# Altium schematic sheet MCU.SchDoc
size A4; PageSetup: Record=PageOptions|CenterHorizontal=True|CenterVertical=True|PrintScale=0.98|XCorrection=1.00|YCorrection=1.00|PrintKind=1|BorderSize=5000000|LeftOffset=0|BottomOffset=0|Orientation=2|PaperLength=1000|PaperWidth=1000|Scale=100|PaperSource=7|PrintQuality=-3|MediaType=1|DitherType=10|PrintScaleMode=1|PaperKind=Carta|PaperIndex=1
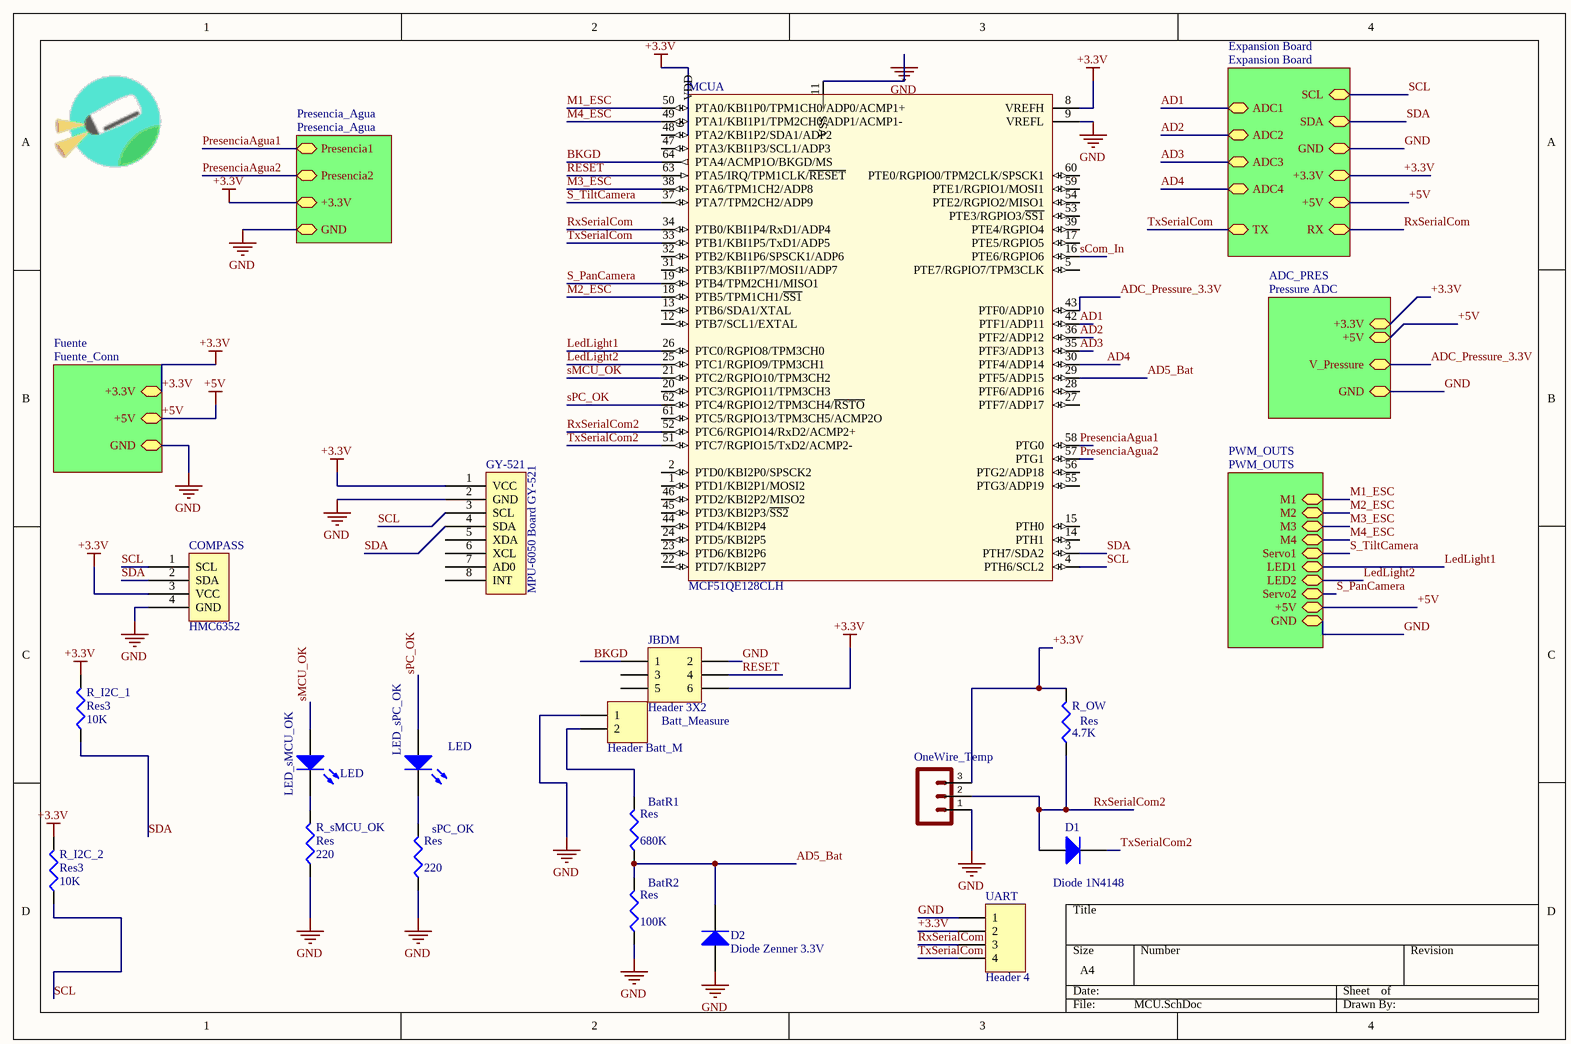
[diagram p0: MCU.SchDoc]

## Parts
BatR1  Res  value 680K  [6-0805_L]
BatR2  Res  value 100K  [6-0805_L]
Batt_Measure  Header Batt_M  [5.08mm 200 mil Screw Terminal SF]
COMPASS  HMC6352  [HMC6352_SF]
D1  Diode 1N4148  [miniMELF]
D2  Diode Zenner 3.3V  [miniMELF]
GY-521  MPU-6050 Board GY-521  [GY-521]
JBDM  Header 3X2  [HDR2X3]
LED_sMCU_OK  LED  [6-0805_L]
LED_sPC_OK  LED  [6-0805_L]
MCU  MCF51QE128CLH  [840F-02_N]  (part A of 2)
OneWire_Temp  (no value)  [HDR1X3]
R_I2C_1  Res3  value 10K  [6-0805_L]
R_I2C_2  Res3  value 10K  [6-0805_L]
R_OW  Res  value 4.7K  [6-0805_L]
R_sMCU_OK  Res  value 220  [6-0805_L]
sPC_OK  Res  value 220  [6-0805_L]
UART  Header 4  [HDR1X4]

## Sub-sheets
ADC_PRES = Pressure ADC: +3.3V, GND, V_Pressure (bidir), +5V
Expansion Board = Expansion Board: SCL, SDA, GND, +3.3V, +5V, ADC4 (bidir), ADC1 (bidir), ADC2 (bidir), ADC3 (bidir), RX, TX
Fuente = Fuente_Conn: +3.3V, +5V, GND
Presencia_Agua = Presencia_Agua: GND, +3.3V, Presencia2, Presencia1
PWM_OUTS = PWM_OUTS: M1, M2, M3, M4, LED1, LED2, +5V, GND, Servo1, Servo2

## Nets
+3.3V: COMPASS.3(VCC) GY-521.1(VCC) JBDM.6 MCU.6(VDD) MCU.8(VREFH) OneWire_Temp.3 R_I2C_1.2 R_I2C_2.2 R_OW.2 UART.2 ; sheet Fuente/+3.3V, sheet Expansion Board/+3.3V, sheet ADC_PRES/+3.3V, sheet Presencia_Agua/+3.3V
+5V: sheet Fuente/+5V, sheet Expansion Board/+5V, sheet ADC_PRES/+5V, sheet PWM_OUTS/+5V
GND: BatR2.1 Batt_Measure.1 COMPASS.4(GND) D2.1(A) GY-521.2(GND) JBDM.2 MCU.9(VREFL) MCU.11(VSS) OneWire_Temp.1 R_sMCU_OK.1 sPC_OK.1 UART.1 ; sheet Fuente/GND, sheet Expansion Board/GND, sheet ADC_PRES/GND, sheet PWM_OUTS/GND, sheet Presencia_Agua/GND
AD1: MCU.42(PTF1/ADP11) ; sheet Expansion Board/ADC1
AD2: MCU.36(PTF2/ADP12) ; sheet Expansion Board/ADC2
AD3: MCU.35(PTF3/ADP13) ; sheet Expansion Board/ADC3
AD4: MCU.30(PTF4/ADP14) ; sheet Expansion Board/ADC4
AD5_Bat: BatR1.1 BatR2.2 D2.2(K) MCU.29(PTF5/ADP15)
ADC_Pressure_3.3V: MCU.43(PTF0/ADP10) ; sheet ADC_PRES/V_Pressure
BKGD: JBDM.1 MCU.64(PTA4/ACMP1O/BKGD/MS)
LedLight1: MCU.26(PTC0/RGPIO8/TPM3CH0) ; sheet PWM_OUTS/LED1
LedLight2: MCU.25(PTC1/RGPIO9/TPM3CH1) ; sheet PWM_OUTS/LED2
M1_ESC: MCU.50(PTA0/KBI1P0/TPM1CH0/ADP0/ACMP1+) ; sheet PWM_OUTS/M1
M2_ESC: MCU.18(PTB5/TPM1CH1/~{SS1}) ; sheet PWM_OUTS/M2
M3_ESC: MCU.38(PTA6/TPM1CH2/ADP8) ; sheet PWM_OUTS/M3
M4_ESC: MCU.49(PTA1/KBI1P1/TPM2CH0/ADP1/ACMP1-) ; sheet PWM_OUTS/M4
PresenciaAgua1: MCU.58(PTG0) ; sheet Presencia_Agua/Presencia1
PresenciaAgua2: MCU.57(PTG1) ; sheet Presencia_Agua/Presencia2
RESET: JBDM.4 MCU.63(PTA5/IRQ/TPM1CLK/~{RESET})
RxSerialCom: MCU.34(PTB0/KBI1P4/RxD1/ADP4) UART.3 ; sheet Expansion Board/RX
RxSerialCom2: D1.1(A) MCU.52(PTC6/RGPIO14/RxD2/ACMP2+) OneWire_Temp.2 R_OW.1
S_PanCamera: MCU.19(PTB4/TPM2CH1/MISO1) ; sheet PWM_OUTS/Servo2
S_TiltCamera: MCU.37(PTA7/TPM2CH2/ADP9) ; sheet PWM_OUTS/Servo1
SCL: COMPASS.1(SCL) GY-521.3(SCL) MCU.4(PTH6/SCL2) R_I2C_2.1 ; sheet Expansion Board/SCL
sCom_In: MCU.16(PTE6/RGPIO6)
SDA: COMPASS.2(SDA) GY-521.4(SDA) MCU.3(PTH7/SDA2) R_I2C_1.1 ; sheet Expansion Board/SDA
sMCU_OK: LED_sMCU_OK.1(A) MCU.21(PTC2/RGPIO10/TPM3CH2)
sPC_OK: LED_sPC_OK.1(A) MCU.62(PTC4/RGPIO12/TPM3CH4/~{RSTO})
TxSerialCom: MCU.33(PTB1/KBI1P5/TxD1/ADP5) UART.4 ; sheet Expansion Board/TX
TxSerialCom2: D1.2(K) MCU.51(PTC7/RGPIO15/TxD2/ACMP2-)
NetBatR1_2: BatR1.2 Batt_Measure.2
NetLED_sMCU_OK_2: LED_sMCU_OK.2(K) R_sMCU_OK.2
NetLED_sPC_OK_2: LED_sPC_OK.2(K) sPC_OK.2

Not connected (* = marked no-connect by the designer): GY-521 5(XDA) 6(XCL) 7(AD0) 8(INT); JBDM 3 5; MCU 1(PTD1/KBI2P1/MOSI2) 2(PTD0/KBI2P0/SPSCK2) 5(PTE7/RGPIO7/TPM3CLK) 12(PTB7/SCL1/EXTAL) 13(PTB6/SDA1/XTAL) 14(PTH1) 15(PTH0) 17(PTE5/RGPIO5) 20(PTC3/RGPIO11/TPM3CH3) 22(PTD7/KBI2P7) 23(PTD6/KBI2P6) 24(PTD5/KBI2P5) 27(PTF7/ADP17) 28(PTF6/ADP16) 31(PTB3/KBI1P7/MOSI1/ADP7) 32(PTB2/KBI1P6/SPSCK1/ADP6) 39(PTE4/RGPIO4) 44(PTD4/KBI2P4) 45(PTD3/KBI2P3/~{SS2}) 46(PTD2/KBI2P2/MISO2) 47(PTA3/KBI1P3/SCL1/ADP3) 48(PTA2/KBI1P2/SDA1/ADP2) 53(PTE3/RGPIO3/~{SS1}) 54(PTE2/RGPIO2/MISO1) 55(PTG3/ADP19) 56(PTG2/ADP18) 59(PTE1/RGPIO1/MOSI1) 60(PTE0/RGPIO0/TPM2CLK/SPSCK1) 61(PTC5/RGPIO13/TPM3CH5/ACMP2O)

## Library data of the parts
BatR1 BatR2 R_I2C_1 R_I2C_2 R_OW R_sMCU_OK sPC_OK = Res3: Resistor; Published: 8-Jun-2000; LatestRevisionDate: 29-May-2009; LatestRevisionNote: IPC-7351 Footprint Added.; PackageReference: J1-0603; Publisher: Altium Limited; PackageDescription: Chip Resistor
Batt_Measure = Header 2: Header, 2-Pin; LatestRevisionDate: 17-Jul-2002; LatestRevisionNote: Re-released for DXP Platform.; Publisher: Altium Limited
D1 D2 = Diode 1N4148: High Conductance Fast Diode; Published: 8-Jun-2000; LatestRevisionDate: 17-Jul-2002; LatestRevisionNote: Re-released for DXP Platform.; DatasheetVersion: 1997; PackageReference: DO-35; Publisher: Altium Limited; PackageDescription: Diode, Axial; Body 3.8 x 1.9 mm (LxDia. max), Lead Dia. 0.53 mm (max); Code_JEDEC: DO-204-AH; ComponentLink1Description: Manufacturer Link; ComponentLink1URL: http://www.fairchildsemi.com/; ComponentLink2Description: Datasheet; ComponentLink2URL: http://www.fairchildsemi.com/ds/1N%2F1N4148.pdf
GY-521 = GY-521
JBDM = Header 3X2: Header, 3-Pin, Dual row; LatestRevisionDate: 17-Jul-2002; LatestRevisionNote: Re-released for DXP Platform.; Publisher: Altium Limited
LED_sMCU_OK LED_sPC_OK = LED2: Typical RED, GREEN, YELLOW, AMBER GaAs LED; Published: 8-Jun-2000; LatestRevisionDate: 17-Jul-2002; LatestRevisionNote: Re-released for DXP Platform.; PackageVersion: Feb-2002; PackageReference: 3.2X1.6X1.1; Publisher: Altium Limited; PackageDescription: SM LED; 2 Flat Leads
MCU = MCF51QE128CLH: MCF51QE128 ColdFire V1 Microcontroller, 32-Bit, 128KB Flash, 8KB RAM, -40°C to 85°C, 64-Pin LQFP; DatasheetVersion: rev7, Oct-2008; PackageVersion: rev6, Mar-2011; PackageReference: 840F-02; PackageDescription: 64-Pin Thin Quad Flat Pack, 10 x 10 mm Body, 0.5 mm Pitch; ComponentLink1Description: Manufacturer URL; ComponentLink1URL: http://www.freescale.com/; ComponentLink2Description: Datasheet; ComponentLink2URL: http://cache.freescale.com/files/32bit/doc/data_sheet/MCF51QE128.pdf?fpsp=1&WT_TYPE=Data%20Sheets&WT_VENDOR=FREESCALE&WT_FILE_FORMAT=pdf&WT_ASSET=Documentation
OneWire_Temp = M03-SCREW-5MM: STOREFRONT_ID: PRT-08433
UART = Header 4: Header, 4-Pin; LatestRevisionDate: 17-Jul-2002; LatestRevisionNote: Re-released for DXP Platform.; Publisher: Altium Limited